# Altium schematic sheet PAYL0012 GMSK Prototyping Board no proto.SchDoc: GMSK Prototyping Board w/o prototyping
size A3; Author: Daniel Jedrychowski; CompanyName: BLUESAT Satellite Project; Engineer: Daniel Jedrychowski; Organization: BLUESat Project; Address1: Room 419; Address2: School of EE&T; Address3: UNSW, NSW 2052; Address4: Australia; DocumentNumber: PAYL0012; SheetNumber: 1; SheetTotal: 2; Description: Board housing 2 GMSK Modems with loopback capability; Version: 1.0
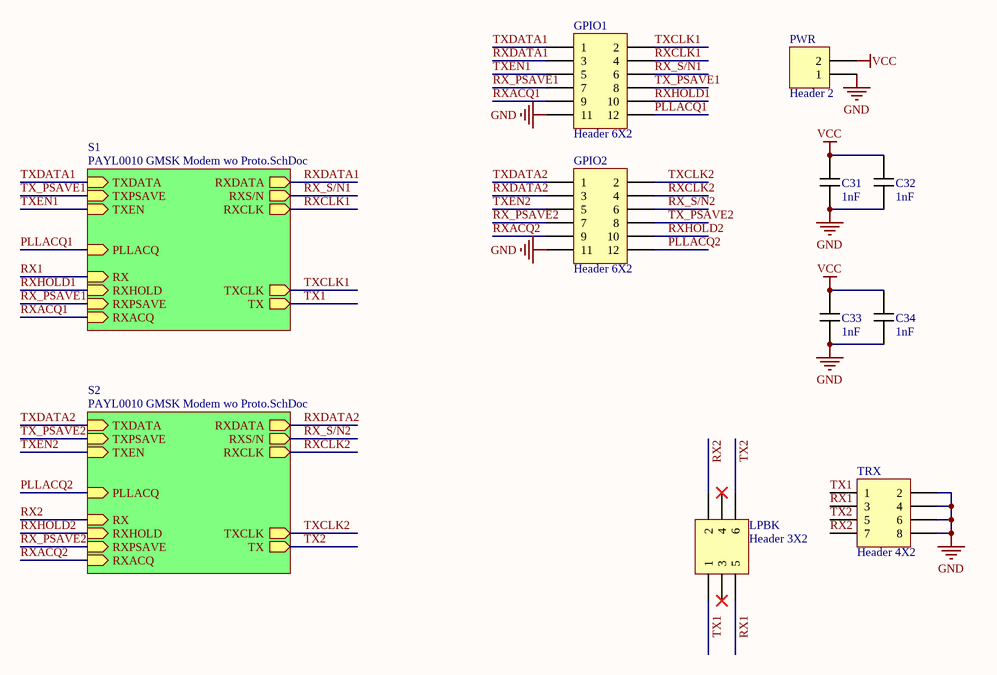
[diagram p0: PAYL0012 GMSK Prototyping Board no proto.SchDoc]

## Parts
C31  value 1nF  [0805 Cap]  (hidden comment: 0805 Cap)
C32  value 1nF  [0805 Cap]  (hidden comment: 0805 Cap)
C33  value 1nF  [0805 Cap]  (hidden comment: 0805 Cap)
C34  value 1nF  [0805 Cap]  (hidden comment: 0805 Cap)
GPIO1  Header 6X2  [HDR2X6]
GPIO2  Header 6X2  [HDR2X6]
LPBK  Header 3X2  [HDR2X3]
PWR  Header 2  [HDR1X2]
TRX  Header 4X2  [HDR2X4]

## Sub-sheets
S1 = PAYL0010 GMSK Modem wo Proto.SchDoc: TX (out), RX (in), TXDATA (in), RXDATA (out), RXCLK (out), TXCLK (out), PLLACQ (in), RXACQ (in), TXEN (in), RXHOLD (in), TXPSAVE (in), RXPSAVE (in), RXS/N (out)
S2 = PAYL0010 GMSK Modem wo Proto.SchDoc: TX (out), RX (in), TXDATA (in), RXDATA (out), RXCLK (out), TXCLK (out), PLLACQ (in), RXACQ (in), TXEN (in), RXHOLD (in), TXPSAVE (in), RXPSAVE (in), RXS/N (out)

## Nets
GND: C31.2 C32.2 C33.1 C34.1 GPIO1.11 GPIO2.11 PWR.1 TRX.2 TRX.4 TRX.6 TRX.8
VCC: C31.1 C32.1 C33.2 C34.2 PWR.2
PLLACQ1: GPIO1.12 ; sheet S1/PLLACQ
PLLACQ2: GPIO2.12 ; sheet S2/PLLACQ
RX1: LPBK.5 TRX.3 ; sheet S1/RX
RX2: LPBK.2 TRX.7 ; sheet S2/RX
RX_PSAVE1: GPIO1.7 ; sheet S1/RXPSAVE
RX_PSAVE2: GPIO2.7 ; sheet S2/RXPSAVE
RX_S/N1: GPIO1.6 ; sheet S1/RXS/N
RX_S/N2: GPIO2.6 ; sheet S2/RXS/N
RXACQ1: GPIO1.9 ; sheet S1/RXACQ
RXACQ2: GPIO2.9 ; sheet S2/RXACQ
RXCLK1: GPIO1.4 ; sheet S1/RXCLK
RXCLK2: GPIO2.4 ; sheet S2/RXCLK
RXDATA1: GPIO1.3 ; sheet S1/RXDATA
RXDATA2: GPIO2.3 ; sheet S2/RXDATA
RXHOLD1: GPIO1.10 ; sheet S1/RXHOLD
RXHOLD2: GPIO2.10 ; sheet S2/RXHOLD
TX1: LPBK.1 TRX.1 ; sheet S1/TX
TX2: LPBK.6 TRX.5 ; sheet S2/TX
TX_PSAVE1: GPIO1.8 ; sheet S1/TXPSAVE
TX_PSAVE2: GPIO2.8 ; sheet S2/TXPSAVE
TXCLK1: GPIO1.2 ; sheet S1/TXCLK
TXCLK2: GPIO2.2 ; sheet S2/TXCLK
TXDATA1: GPIO1.1 ; sheet S1/TXDATA
TXDATA2: GPIO2.1 ; sheet S2/TXDATA
TXEN1: GPIO1.5 ; sheet S1/TXEN
TXEN2: GPIO2.5 ; sheet S2/TXEN

Not connected (* = marked no-connect by the designer): LPBK 3* 4*

## Notes on the sheet
- Title
- Description:
- Size:
- Author:
- Date:
- A3
- Time:
- Version
- Sheet:
- Drawing No.:
- of
- File:

## Library data of the parts
C31-C34 = 0805 MLCC - X7R, 10%
GPIO1 GPIO2 = Header 6X2: Header, 6-Pin, Dual row; LatestRevisionDate: 17-Jul-2002; LatestRevisionNote: Re-released for DXP Platform.; Publisher: Altium Limited
LPBK = Header 3X2: Header, 3-Pin, Dual row; LatestRevisionDate: 17-Jul-2002; LatestRevisionNote: Re-released for DXP Platform.; Publisher: Altium Limited
PWR = Header 2: Header, 2-Pin; LatestRevisionDate: 17-Jul-2002; LatestRevisionNote: Re-released for DXP Platform.; Publisher: Altium Limited
TRX = Header 4X2: Header, 4-Pin, Dual row; LatestRevisionDate: 17-Jul-2002; LatestRevisionNote: Re-released for DXP Platform.; Publisher: Altium Limited